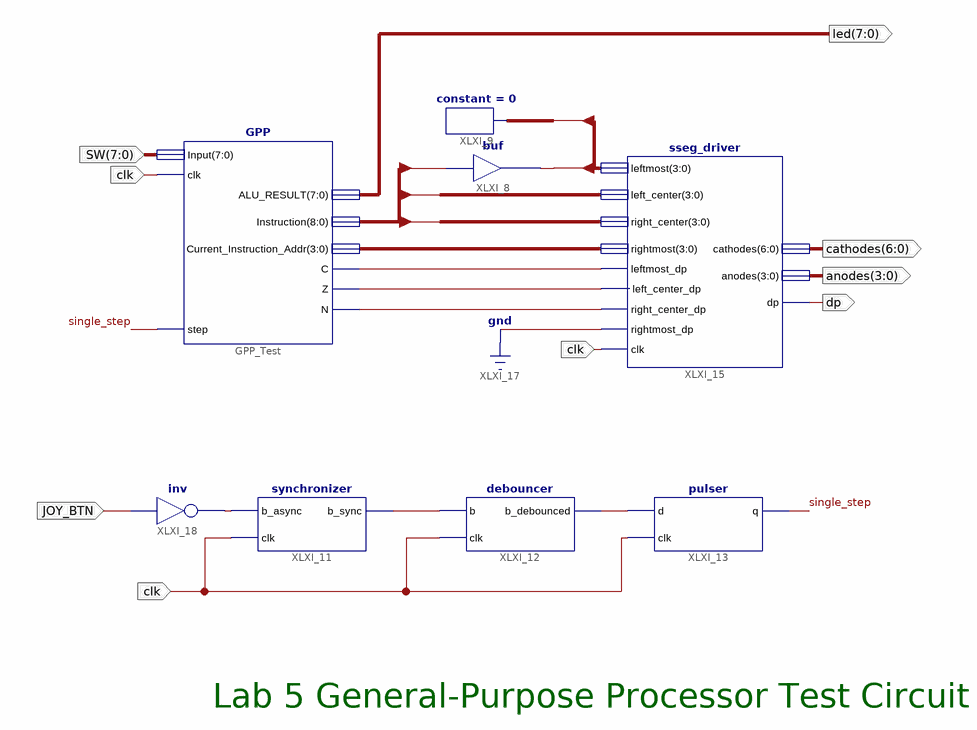
[diagram p0: schematic sheet 1]
// Xilinx ISE schematic GPPTestCircuit.sch (spartan3e) as structural Verilog: 8 symbols, 7 ports
module GPPTestCircuit (
  input  [7:0] SW,
  input  JOY_BTN,
  input  clk,
  output [3:0] anodes,
  output [6:0] cathodes,
  output [7:0] led,
  output dp
);

  wire single_step, XLXN_20, XLXN_21, XLXN_23, XLXN_24, XLXN_25, XLXN_29;
  wire [3:0] leftmost, XLXN_19;
  wire [8:0] Instruction;

  buf XLXI_8 (leftmost[0], Instruction[8]);
  constant #(.CValue("0")) XLXI_9 (.O(leftmost[3:1]));
  GPP GPP_Test (
    .clk(clk), .Input(SW), .C(XLXN_23), .N(XLXN_25), .Z(XLXN_24), .Current_Instruction_Addr(XLXN_19),
    .Instruction(Instruction), .ALU_RESULT(led), .step(single_step));
  sseg_driver XLXI_15 (
    .right_center(Instruction[3:0]), .rightmost(XLXN_19), .left_center(Instruction[7:4]),
    .leftmost(leftmost), .anodes(anodes), .cathodes(cathodes), .leftmost_dp(XLXN_23),
    .left_center_dp(XLXN_24), .right_center_dp(XLXN_25), .clk(clk), .rightmost_dp(1'b0), .dp(dp));
  debouncer XLXI_12 (.b(XLXN_20), .clk(clk), .b_debounced(XLXN_21));
  pulser XLXI_13 (.clk(clk), .d(XLXN_21), .q(single_step));
  synchronizer XLXI_11 (.b_async(XLXN_29), .clk(clk), .b_sync(XLXN_20));
  not XLXI_18 (XLXN_29, JOY_BTN);

  // Notes on the sheet:
  //   Lab 5 General-Purpose Processor Test Circuit
endmodule
